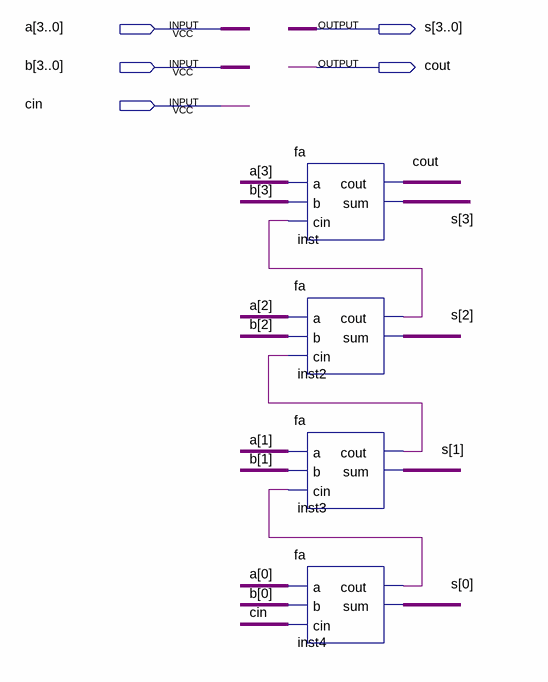
[diagram p0: schematic sheet]
// Quartus schematic four_bit_ripple_carry.bdf as structural Verilog: 4 symbols, 5 pins
module four_bit_ripple_carry (
  input  [3:0] a,
  input  [3:0] b,
  input  cin,
  output [3:0] s,
  output cout
);

  wire inst2_cout, inst3_cout, inst4_cout;

  fa inst (.a(a[3]), .b(b[3]), .cin(inst2_cout), .cout(cout), .sum(s[3]));
  fa inst2 (.a(a[2]), .b(b[2]), .cin(inst3_cout), .cout(inst2_cout), .sum(s[2]));
  fa inst3 (.a(a[1]), .b(b[1]), .cin(inst4_cout), .cout(inst3_cout), .sum(s[1]));
  fa inst4 (.a(a[0]), .b(b[0]), .cin(cin), .cout(inst4_cout), .sum(s[0]));
endmodule
